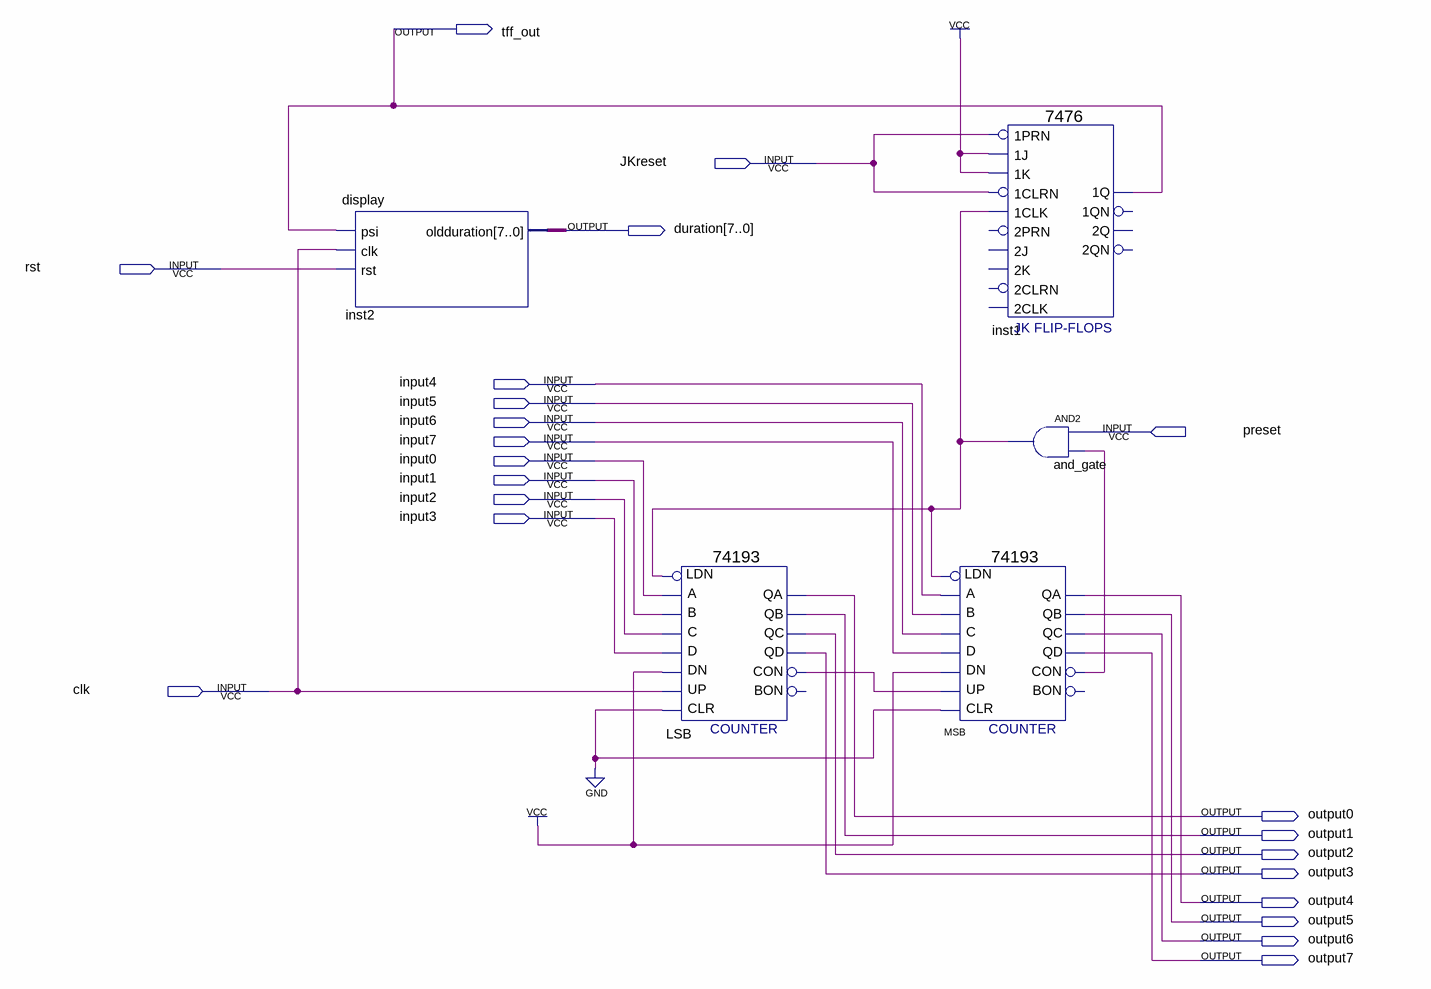
[diagram p0: schematic sheet]
// Quartus schematic count113.bdf as structural Verilog: 5 symbols, 22 pins
module count113 (
  input  JKreset,
  input  rst,
  input  input4,
  input  input5,
  input  input6,
  input  preset,
  input  input7,
  input  input0,
  input  input1,
  input  input2,
  input  input3,
  input  clk,
  output tff_out,
  output [7:0] duration,
  output output0,
  output output1,
  output output2,
  output output3,
  output output4,
  output output5,
  output output6,
  output output7
);

  wire and_gate_out, LSB_con, MSB_con;

  display inst2 (.psi(tff_out), .clk(clk), .rst(rst), .oldduration(duration));
  \74193  LSB (
    .D(input3), .C(input2), .B(input1), .A(input0), .CLR(1'b0), .UP(clk), .DN(1'b1), .LDN(and_gate_out),
    .QB(output1), .QA(output0), .CON(LSB_con), .QD(output3), .QC(output2));  // open: BON
  \74193  MSB (
    .D(input7), .C(input6), .B(input5), .A(input4), .CLR(1'b0), .UP(LSB_con), .DN(1'b1), .LDN(and_gate_out),
    .QB(output5), .QA(output4), .CON(MSB_con), .QD(output7), .QC(output6));  // open: BON
  \7476  inst1 (
    .\1J (1'b1), .\1K (1'b1), .\1PRN (JKreset), .\1CLK (and_gate_out), .\1CLRN (JKreset), .\1Q (tff_out));  // open: 2PRN, 2J, 2K, 2CLRN, 2CLK, 2QN, 2Q, 1QN
  and and_gate (and_gate_out, preset, MSB_con);
endmodule
